# EAGLE board bms1ry (EAGLE 4.13), part 1 of 2
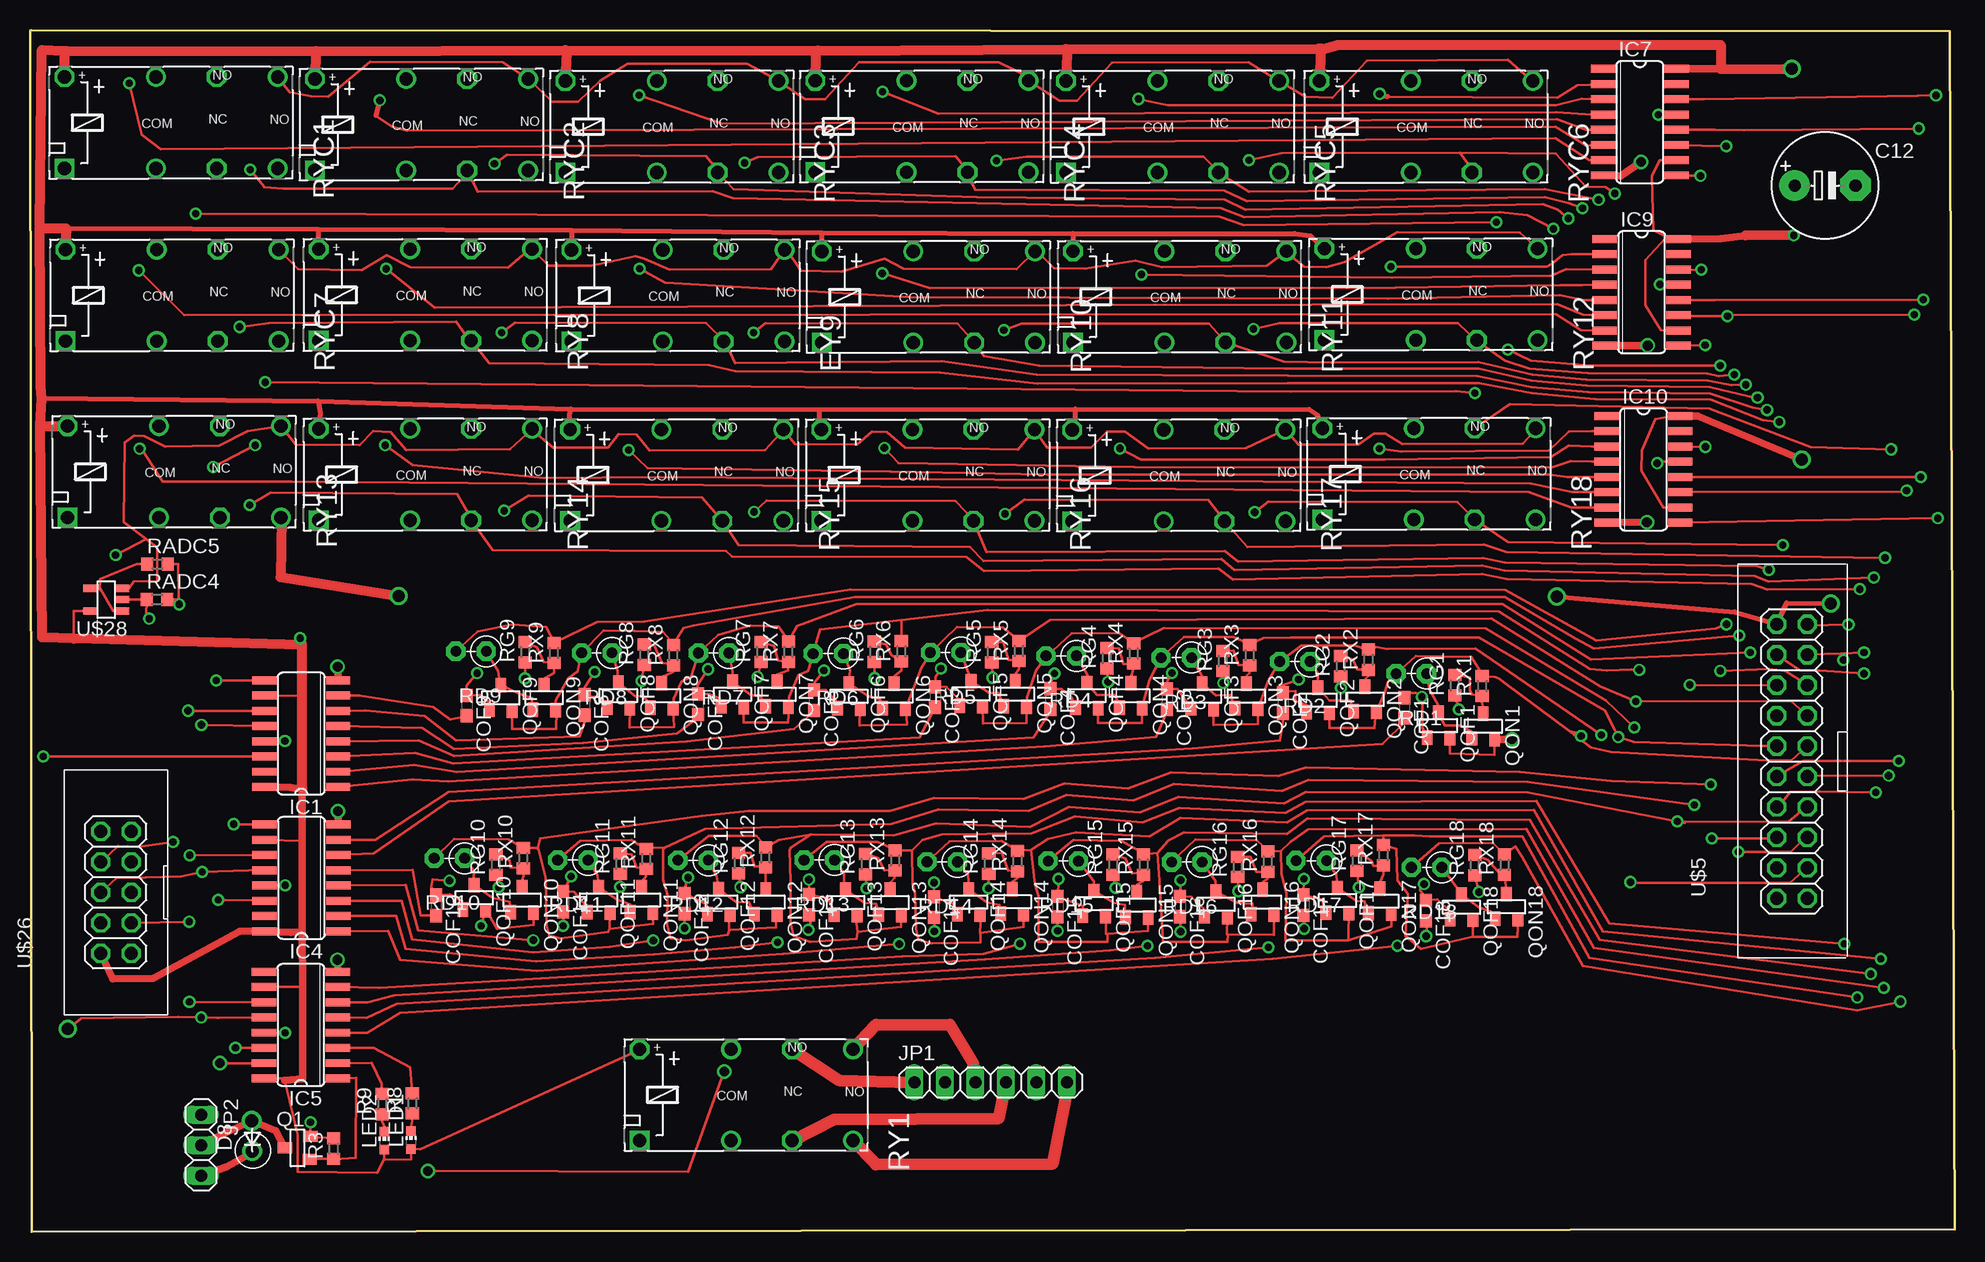
[diagram p2: board, top side]
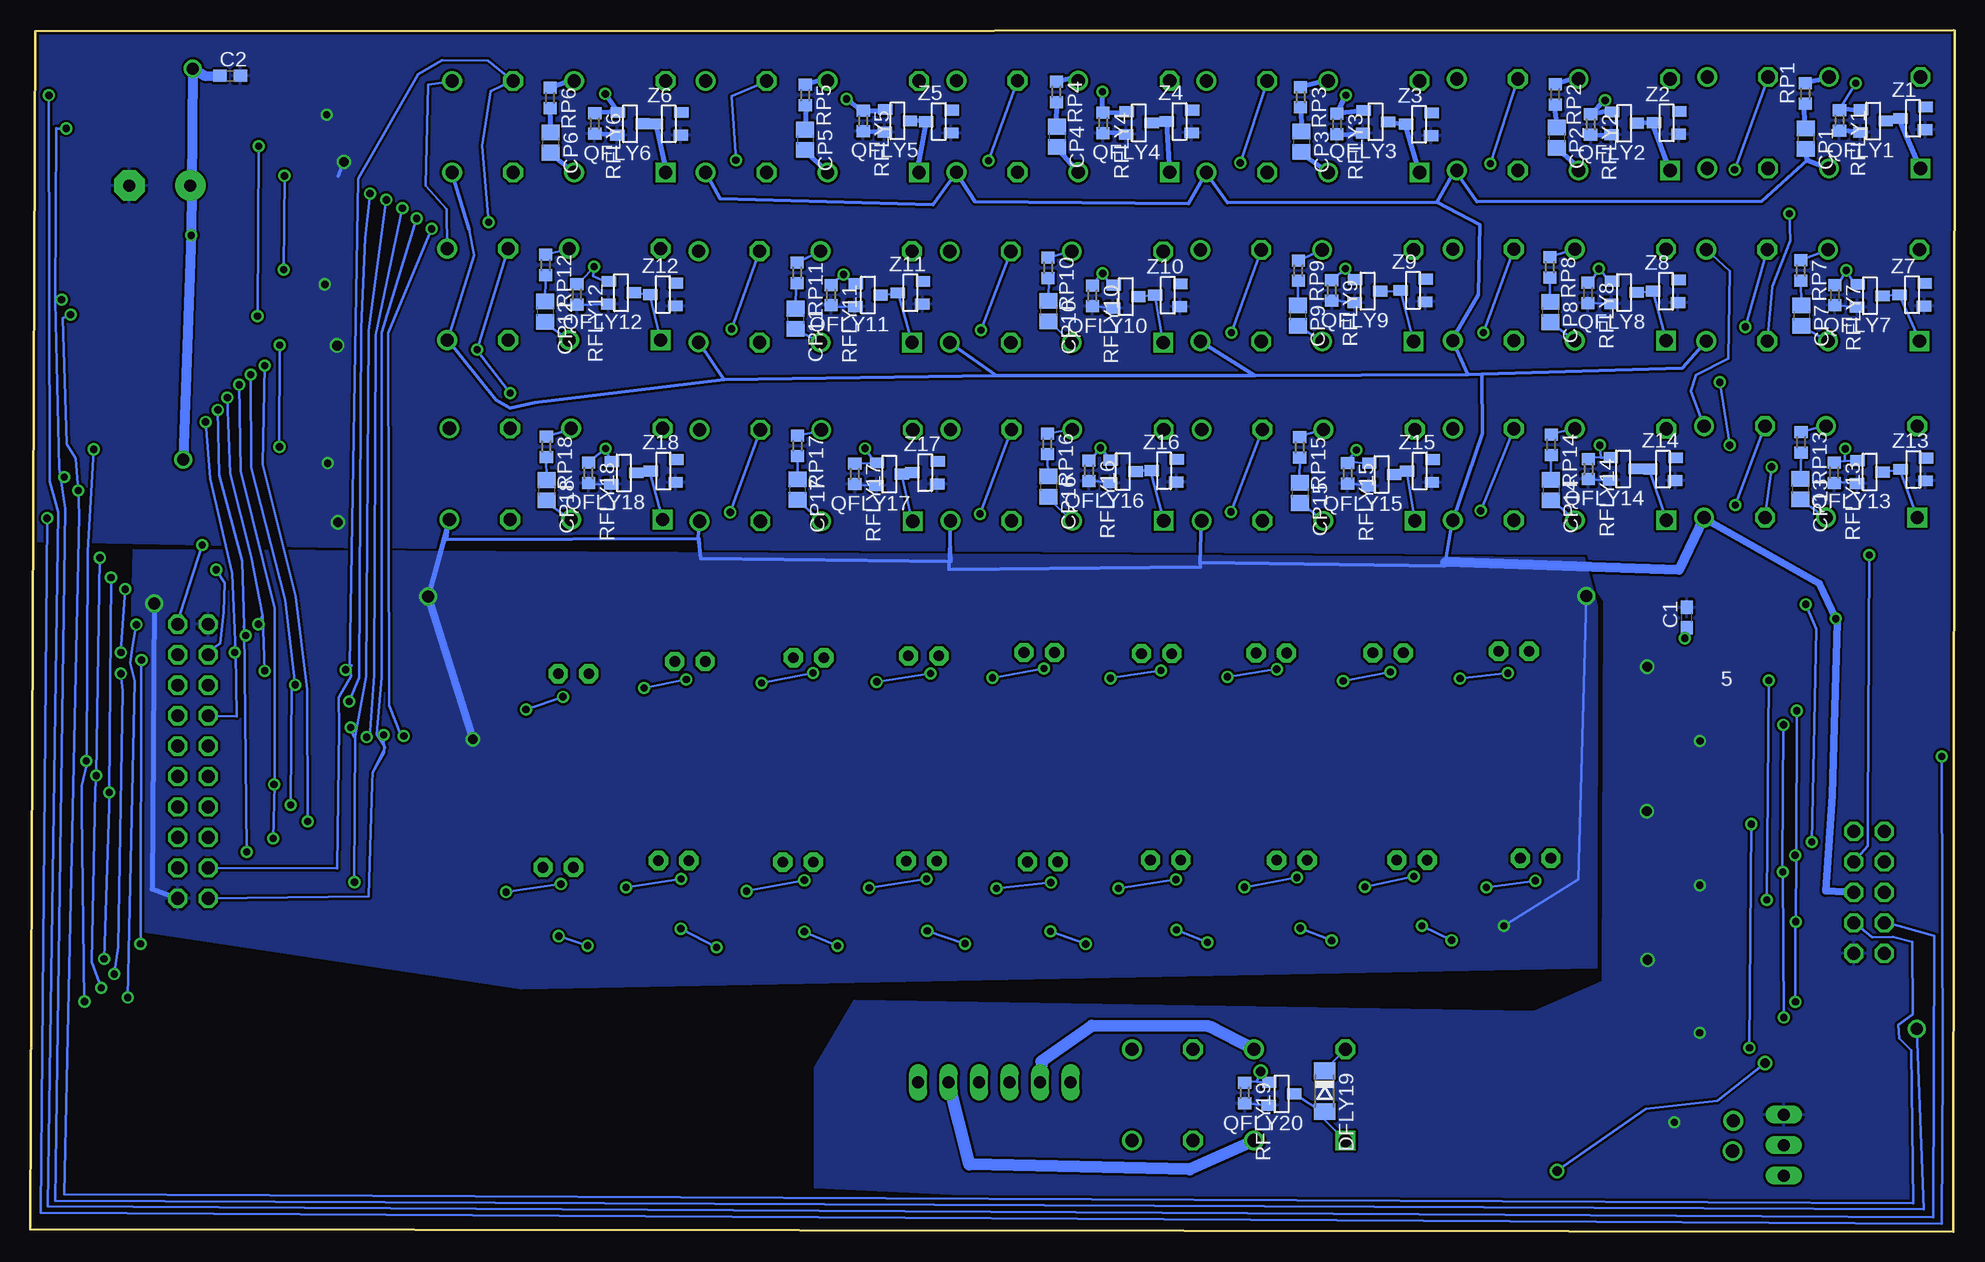
[diagram p3: board, bottom side, seen from below]

Size 160.43 x 100.2 mm. Coordinates in mm from the lower left corner, seen from the top.
Outline: 0,100.15 0.13,0 160.43,0.22 160.01,100.1 0.08,100.2
Copper layers (1*16): Top 0.035mm / dielectric 1.5mm / Bottom 0.035mm
Design rules "default": minimum track width 8mil, minimum drill 0.6mm, track to track 8mil, track to pad 8mil, pad to pad 8mil, via to via 8mil, smd to smd 0mil, copper to edge 8mil, drill to drill 8mil, minimum pad ring 10mil, minimum via ring 8mil, stop-mask expansion 4mil, vias tented up to drill 0mil, thermal gap 10mil

## Footprints (pad centres in the part's own frame; a part is rotated, then mirrored left to right if it is on the bottom)
C0603 = smd 1.1 x 1: 1 -0.85,0; 2 0.85,0
E5-8,5 = drill 1.016 pad 2.54 round: + -2.54,0 | drill 1.016 pad 2.54 octagon: - 2.54,0
C0805 = smd 1.3 x 1.5: 1 -0.85,0; 2 0.85,0
DO41-10_VERT = drill 1.1 round: A 2.58,0.05; C 0.07,0
SOD80C = smd 1.4 x 1.8: A 1.7,0; C -1.7,0
J104D = drill 1.1 round: 3 0,6.35; 5 10.16,6.35; 8 10.16,-1.27; 10 0,-1.27 | drill 1.1 octagon: 4 5.08,6.35; 9 5.08,-1.27; + -7.62,6.35 | drill 1.1 square: - -7.62,-1.27
SO16 = smd 0.66 x 2.032: 1 -4.445,-3.073; 2 -3.175,-3.073; 3 -1.905,-3.073; 4 -0.635,-3.073; 5 0.635,-3.073; 6 1.905,-3.073; 7 3.175,-3.073; 8 4.445,-3.073; 9 4.445,3.073; 10 3.175,3.073; 11 1.905,3.073; 12 0.635,3.073; 13 -0.635,3.073; 14 -1.905,3.073; 15 -3.175,3.073; 16 -4.445,3.073
1X06 = drill 1 long: 1 -6.35,0; 2 -3.81,0; 3 -1.27,0; 4 1.27,0; 5 3.81,0; 6 6.35,0
1X03 = drill 1 long: 1 -2.54,0; 2 0,0; 3 2.54,0
CHIP-LED0603 = smd 0.8 x 0.8: A 0,-0.75; C 0,0.75
SOT-23 = smd 0.9 x 1.2: 1 -1,-1.006; 2 0.9,-1.056; 3 -0.05,1.056
R0603 = smd 1 x 1.1: 1 -0.85,0; 2 0.85,0
RS-2,5 = drill 0.889 pad 1.6 octagon: 1 0,0; 2 2.54,0
2X10_KEYED = drill 1.067 octagon: 1 -11.46,-1.27; 2 -11.46,1.27; 3 -8.92,-1.27; 4 -8.92,1.27; 5 -6.38,-1.27; 6 -6.38,1.27; 7 -3.84,-1.27; 8 -3.84,1.27; 9 -1.3,-1.27; 10 -1.3,1.27; 11 1.24,-1.27; 12 1.24,1.27; 13 3.78,-1.27; 14 3.78,1.27; 15 6.32,-1.27; 16 6.32,1.27; 17 8.86,-1.27; 18 8.86,1.27; 19 11.4,-1.27; 20 11.4,1.27
2X05_KEYED = drill 1.067 octagon: 1 -5.08,-1.27; 2 -5.08,1.27; 3 -2.54,-1.27; 4 -2.54,1.27; 5 0,-1.27; 6 0,1.27; 7 2.54,-1.27; 8 2.54,1.27; 9 5.08,-1.27; 10 5.08,1.27
SOT23-5 = smd 0.6 x 1.2: 1 -0.95,-1.306; 2 0,-1.306; 3 0.95,-1.306; 4 0.95,1.306; 5 -0.95,1.306

## Placement (x,y rotation side)
C1  0.1u  [C0603]  22.33,51.22 90 bottom
C2  0.1u  [C0603]  143.74,96.38 0 bottom
C12  100u  [E5-8,5]  149.61,87.23 0 top
COF1  0.1u  [C0603]  114.53,43.69 270 top
COF2  0.1u  [C0603]  104.42,44.1 270 top
COF3  0.1u  [C0603]  94.76,44.41 270 top
COF4  0.1u  [C0603]  85.05,44.43 270 top
COF5  0.1u  [C0603]  75.43,44.59 270 top
COF6  0.1u  [C0603]  65.35,44.32 270 top
COF7  0.1u  [C0603]  55.67,43.99 270 top
COF8  0.1u  [C0603]  46.19,43.93 270 top
COF9  0.1u  [C0603]  36.38,43.88 270 top
COF10  0.1u  [C0603]  33.83,27.22 270 top
COF11  0.1u  [C0603]  44.43,27.54 270 top
COF12  0.1u  [C0603]  54.53,27.38 270 top
COF13  0.1u  [C0603]  64.92,27.28 270 top
COF14  0.1u  [C0603]  75.33,27.07 270 top
COF15  0.1u  [C0603]  85.63,27.12 270 top
COF16  0.1u  [C0603]  95.85,27.13 270 top
COF17  0.1u  [C0603]  106.14,27.25 270 top
COF18  0.1u  [C0603]  116.35,26.78 270 top
CP1  4.7u  [C0805]  12.41,91.15 270 bottom
CP2  4.7u  [C0805]  33.18,91.23 270 bottom
CP3  4.7u  [C0805]  54.44,90.9 270 bottom
CP4  4.7u  [C0805]  74.84,91.29 270 bottom
CP5  4.7u  [C0805]  95.81,91.04 270 bottom
CP6  4.7u  [C0805]  117.03,90.82 270 bottom
CP7  4.7u  [C0805]  12.77,76.4 270 bottom
CP8  4.7u  [C0805]  33.71,76.7 270 bottom
CP9  4.7u  [C0805]  54.76,76.39 270 bottom
CP10  4.7u  [C0805]  75.53,76.77 270 bottom
CP11  4.7u  [C0805]  96.62,76.12 270 bottom
CP12  4.7u  [C0805]  117.5,76.73 270 bottom
CP13  4.7u  [C0805]  12.87,61.92 270 bottom
CP14  4.7u  [C0805]  33.67,61.85 270 bottom
CP15  4.7u  [C0805]  54.57,61.61 270 bottom
CP16  4.7u  [C0805]  75.54,62.14 270 bottom
CP17  4.7u  [C0805]  96.47,61.9 270 bottom
CP18  4.7u  [C0805]  117.36,61.83 270 bottom
D8  1N4004_VERT  [DO41-10_VERT]  18.51,6.68 90 top
DFLY19  [SOD80C]  52.51,11.74 270 bottom
EY9  J104D  [J104D]  52.72,75.52 0 top
IC1  74LS595D  [SO16]  22.59,41.54 90 top
IC4  74LS595D  [SO16]  22.6,29.51 90 top
IC5  74LS595D  [SO16]  22.56,17.25 90 top
IC7  74LS595D  [SO16]  134.16,92.52 270 top
IC9  74LS595D  [SO16]  134.31,78.33 270 top
IC10  74LS595D  [SO16]  134.47,63.57 270 top
JP1  [1X06]  80.05,12.47 0 top
JP2  [1X03]  14.24,7.24 270 top
LED1  [CHIP-LED0603]  31.74,7.66 0 top
LED2  [CHIP-LED0603]  29.51,7.61 0 top
Q1  NFET  [SOT-23]  22.28,7.06 90 top
QFLY1  NFET  [SOT-23]  6.8,92.56 270 bottom
QFLY2  NFET  [SOT-23]  27.55,92.37 270 bottom
QFLY3  NFET  [SOT-23]  48.27,92.49 270 bottom
QFLY4  NFET  [SOT-23]  68,92.4 270 bottom
QFLY5  NFET  [SOT-23]  88.13,92.57 270 bottom
QFLY6  NFET  [SOT-23]  110.42,92.33 270 bottom
QFLY7  NFET  [SOT-23]  7.07,77.99 270 bottom
QFLY8  NFET  [SOT-23]  27.56,78.27 270 bottom
QFLY9  NFET  [SOT-23]  48.95,78.38 270 bottom
QFLY10  NFET  [SOT-23]  69.09,77.92 270 bottom
QFLY11  NFET  [SOT-23]  90.59,78.05 270 bottom
QFLY12  NFET  [SOT-23]  111.16,78.25 270 bottom
QFLY13  NFET  [SOT-23]  7.08,63.3 270 bottom
QFLY14  NFET  [SOT-23]  27.65,63.56 270 bottom
QFLY15  NFET  [SOT-23]  47.78,63.09 270 bottom
QFLY16  NFET  [SOT-23]  69.33,63.35 270 bottom
QFLY17  NFET  [SOT-23]  88.82,63.12 270 bottom
QFLY18  NFET  [SOT-23]  110.93,63.23 270 bottom
QFLY20  NFET  [SOT-23]  56.11,11.46 270 bottom
QOF1  NFET  [SOT-23]  117.43,42.22 0 top
QOF2  NFET  [SOT-23]  107.39,44.32 0 top
QOF3  NFET  [SOT-23]  97.74,44.64 0 top
QOF4  NFET  [SOT-23]  88.12,44.71 0 top
QOF5  NFET  [SOT-23]  78.47,44.86 0 top
QOF6  NFET  [SOT-23]  68.28,44.65 0 top
QOF7  NFET  [SOT-23]  58.58,44.81 0 top
QOF8  NFET  [SOT-23]  49.07,44.72 0 top
QOF9  NFET  [SOT-23]  39.27,44.52 0 top
QOF10  NFET  [SOT-23]  37.06,27.86 0 top
QOF11  NFET  [SOT-23]  47.42,27.67 0 top
QOF12  NFET  [SOT-23]  57.43,27.51 0 top
QOF13  NFET  [SOT-23]  68.01,27.47 0 top
QOF14  NFET  [SOT-23]  78.27,27.5 0 top
QOF15  NFET  [SOT-23]  88.72,27.37 0 top
QOF16  NFET  [SOT-23]  98.88,27.31 0 top
QOF17  NFET  [SOT-23]  109.01,27.62 0 top
QOF18  NFET  [SOT-23]  119.35,27.07 0 top
QON1  NFET  [SOT-23]  121.16,42.14 0 top
QON2  NFET  [SOT-23]  111.31,44.4 0 top
QON3  NFET  [SOT-23]  101.42,44.66 0 top
QON4  NFET  [SOT-23]  91.79,44.7 0 top
QON5  NFET  [SOT-23]  82.15,44.84 0 top
QON6  NFET  [SOT-23]  72.04,44.66 0 top
QON7  NFET  [SOT-23]  62.29,44.82 0 top
QON8  NFET  [SOT-23]  52.68,44.69 0 top
QON9  NFET  [SOT-23]  42.89,44.54 0 top
QON10  NFET  [SOT-23]  41.04,27.67 0 top
QON11  NFET  [SOT-23]  51,27.67 0 top
QON12  NFET  [SOT-23]  61.36,27.5 0 top
QON13  NFET  [SOT-23]  71.71,27.47 0 top
QON14  NFET  [SOT-23]  81.9,27.53 0 top
QON15  NFET  [SOT-23]  92.28,27.26 0 top
QON16  NFET  [SOT-23]  102.77,27.49 0 top
QON17  NFET  [SOT-23]  112.54,27.57 0 top
QON18  NFET  [SOT-23]  123.1,27.11 0 top
R3  470K  [R0603]  25.29,6.94 90 top
R8  6.8K  [R0603]  31.86,10.72 90 top
R9  6.8K  [R0603]  29.34,10.66 90 top
RADC4  10K  [R0603]  10.57,52.72 0 top
RADC5  2.7K  [R0603]  10.6,55.67 0 top
RD1  [RS-2,5]  116.4,46.54 180 top
RD2  [RS-2,5]  106.69,47.55 180 top
RD3  ser-IC7-IC9  [RS-2,5]  96.8,47.87 180 top
RD4  [RS-2,5]  87.21,48.02 180 top
RD5  [RS-2,5]  77.57,48.31 180 top
RD6  [RS-2,5]  67.79,48.21 180 top
RD7  [RS-2,5]  58.23,48.26 180 top
RD8  [RS-2,5]  48.49,48.27 180 top
RD9  [RS-2,5]  38.01,48.4 180 top
RD10  [RS-2,5]  36.2,31.15 180 top
RD11  [RS-2,5]  46.5,31 180 top
RD12  [RS-2,5]  56.52,30.98 180 top
RD13  [RS-2,5]  67.04,31 180 top
RD14  [RS-2,5]  77.29,30.85 180 top
RD15  [RS-2,5]  87.38,30.92 180 top
RD16  [RS-2,5]  97.68,30.83 180 top
RD17  [RS-2,5]  108.05,30.95 180 top
RD18  [RS-2,5]  117.67,30.39 180 top
RFLY1  470K  [R0603]  9.6,92.66 270 bottom
RFLY2  470K  [R0603]  30.34,92.33 270 bottom
RFLY3  470K  [R0603]  51.49,92.37 270 bottom
RFLY4  470K  [R0603]  70.99,92.44 270 bottom
RFLY5  470K  [R0603]  90.98,92.62 270 bottom
RFLY6  470K  [R0603]  113.35,92.4 270 bottom
RFLY7  470K  [R0603]  9.99,78.1 270 bottom
RFLY8  470K  [R0603]  30.57,78.28 270 bottom
RFLY9  470K  [R0603]  51.93,78.48 270 bottom
RFLY10  470K  [R0603]  71.87,78.05 270 bottom
RFLY11  470K  [R0603]  93.66,78.1 270 bottom
RFLY12  470K  [R0603]  114.84,78.16 270 bottom
RFLY13  470K  [R0603]  10.04,63.3 270 bottom
RFLY14  470K  [R0603]  30.53,63.6 270 bottom
RFLY15  470K  [R0603]  50.6,63.23 270 bottom
RFLY16  470K  [R0603]  72.16,63.46 270 bottom
RFLY17  470K  [R0603]  91.68,63.19 270 bottom
RFLY18  470K  [R0603]  113.87,63.27 270 bottom
RFLY19  470K  [R0603]  59.18,11.59 270 bottom
RG1  470K  [R0603]  118.74,45.56 90 top
RG2  470K  [R0603]  109.23,47.16 90 top
RG3  470K  [R0603]  99.41,47.6 90 top
RG4  470K  [R0603]  89.74,47.82 90 top
RG5  470K  [R0603]  80.15,48.31 90 top
RG6  470K  [R0603]  70.36,48.36 90 top
RG7  470K  [R0603]  60.92,48.35 90 top
RG8  470K  [R0603]  51.18,48.12 90 top
RG9  470K  [R0603]  41.26,48.34 90 top
RG10  470K  [R0603]  38.81,30.62 90 top
RG11  470K  [R0603]  49.19,30.69 90 top
RG12  470K  [R0603]  59.05,30.74 90 top
RG13  470K  [R0603]  69.63,30.67 90 top
RG14  470K  [R0603]  79.89,30.69 90 top
RG15  470K  [R0603]  90.26,30.63 90 top
RG16  470K  [R0603]  100.65,30.43 90 top
RG17  470K  [R0603]  110.58,30.95 90 top
RG18  470K  [R0603]  120.41,30.57 90 top
RP1  1K  [R0603]  12.45,94.9 90 bottom
RP2  1K  [R0603]  33.29,94.84 270 bottom
RP3  1K  [R0603]  54.53,94.6 270 bottom
RP4  1K  [R0603]  74.87,95.04 270 bottom
RP5  1K  [R0603]  95.81,94.77 270 bottom
RP6  1K  [R0603]  117.08,94.53 270 bottom
RP7  1K  [R0603]  12.83,80.15 270 bottom
RP8  1K  [R0603]  33.75,80.42 270 bottom
RP9  1K  [R0603]  54.71,80.14 270 bottom
RP10  1K  [R0603]  75.57,80.38 270 bottom
RP11  1K  [R0603]  96.49,79.96 270 bottom
RP12  1K  [R0603]  117.45,80.61 270 bottom
RP13  1K  [R0603]  12.8,65.84 270 bottom
RP14  1K  [R0603]  33.62,65.63 270 bottom
RP15  1K  [R0603]  54.59,65.4 270 bottom
RP16  1K  [R0603]  75.63,65.71 270 bottom
RP17  1K  [R0603]  96.45,65.53 270 bottom
RP18  1K  [R0603]  117.39,65.46 270 bottom
RX1  470K  [R0603]  121.02,45.51 90 top
RX2  470K  [R0603]  111.54,47.7 90 top
RX3  470K  [R0603]  101.64,48.08 90 top
RX4  470K  [R0603]  91.97,48.22 90 top
RX5  470K  [R0603]  82.41,48.43 90 top
RX6  470K  [R0603]  72.61,48.4 90 top
RX7  470K  [R0603]  63.2,48.36 90 top
RX8  470K  [R0603]  53.62,48.08 90 top
RX9  470K  [R0603]  43.66,48.26 90 top
RX10  470K  [R0603]  41.1,31.15 90 top
RX11  470K  [R0603]  51.35,31.1 90 top
RX12  470K  [R0603]  61.28,31.22 90 top
RX13  470K  [R0603]  72.09,30.97 90 top
RX14  470K  [R0603]  82.29,30.91 90 top
RX15  470K  [R0603]  92.8,30.63 90 top
RX16  470K  [R0603]  103.16,30.88 90 top
RX17  470K  [R0603]  112.79,31.42 90 top
RX18  470K  [R0603]  122.88,30.61 90 top
RY1  J104D  [J104D]  58.41,8.88 0 top
RY8  J104D  [J104D]  31.67,75.58 0 top
RY10  J104D  [J104D]  73.6,75.4 0 top
RY11  J104D  [J104D]  94.54,75.42 0 top
RY12  J104D  [J104D]  115.49,75.61 0 top
RY13  J104D  [J104D]  10.73,60.83 0 top
RY14  J104D  [J104D]  31.66,60.6 0 top
RY15  J104D  [J104D]  52.61,60.55 0 top
RY16  J104D  [J104D]  73.55,60.55 0 top
RY17  J104D  [J104D]  94.47,60.52 0 top
RY18  J104D  [J104D]  115.32,60.65 0 top
RYC1  J104D  [J104D]  10.47,89.93 0 top
RYC2  J104D  [J104D]  31.34,89.77 0 top
RYC3  J104D  [J104D]  52.22,89.6 0 top
RYC4  J104D  [J104D]  73.05,89.61 0 top
RYC5  J104D  [J104D]  93.95,89.6 0 top
RYC6  J104D  [J104D]  115.08,89.6 0 top
RYC7  J104D  [J104D]  10.55,75.54 0 top
U$5  PINHD-2X10_KEYED  [2X10_KEYED]  146.85,39.26 90 top
U$26  PINHD-2X5_KEYED  [2X05_KEYED]  7.14,28.31 90 top
U$28  MCP6L01  [SOT23-5]  6.33,52.71 90 top
Z1  ZDIO-SOT23  [SOT-23]  3.47,92.88 90 bottom
Z2  ZDIO-SOT23  [SOT-23]  24.01,92.51 90 bottom
Z3  ZDIO-SOT23  [SOT-23]  44.65,92.39 90 bottom
Z4  ZDIO-SOT23  [SOT-23]  64.61,92.62 90 bottom
Z5  ZDIO-SOT23  [SOT-23]  84.66,92.61 90 bottom
Z6  ZDIO-SOT23  [SOT-23]  107.2,92.42 90 bottom
Z7  ZDIO-SOT23  [SOT-23]  3.55,78.17 90 bottom
Z8  ZDIO-SOT23  [SOT-23]  24.07,78.47 90 bottom
Z9  ZDIO-SOT23  [SOT-23]  45.14,78.54 90 bottom
Z10  ZDIO-SOT23  [SOT-23]  65.59,78.14 90 bottom
Z11  ZDIO-SOT23  [SOT-23]  87.05,78.34 90 bottom
Z12  ZDIO-SOT23  [SOT-23]  107.66,78.2 90 bottom
Z13  ZDIO-SOT23  [SOT-23]  3.45,63.62 90 bottom
Z14  ZDIO-SOT23  [SOT-23]  24.31,63.64 90 bottom
Z15  ZDIO-SOT23  [SOT-23]  44.58,63.49 90 bottom
Z16  ZDIO-SOT23  [SOT-23]  65.89,63.51 90 bottom
Z17  ZDIO-SOT23  [SOT-23]  85.82,63.35 90 bottom
Z18  ZDIO-SOT23  [SOT-23]  107.62,63.49 90 bottom